# EAGLE schematic velodyne (EAGLE 8.1.0)
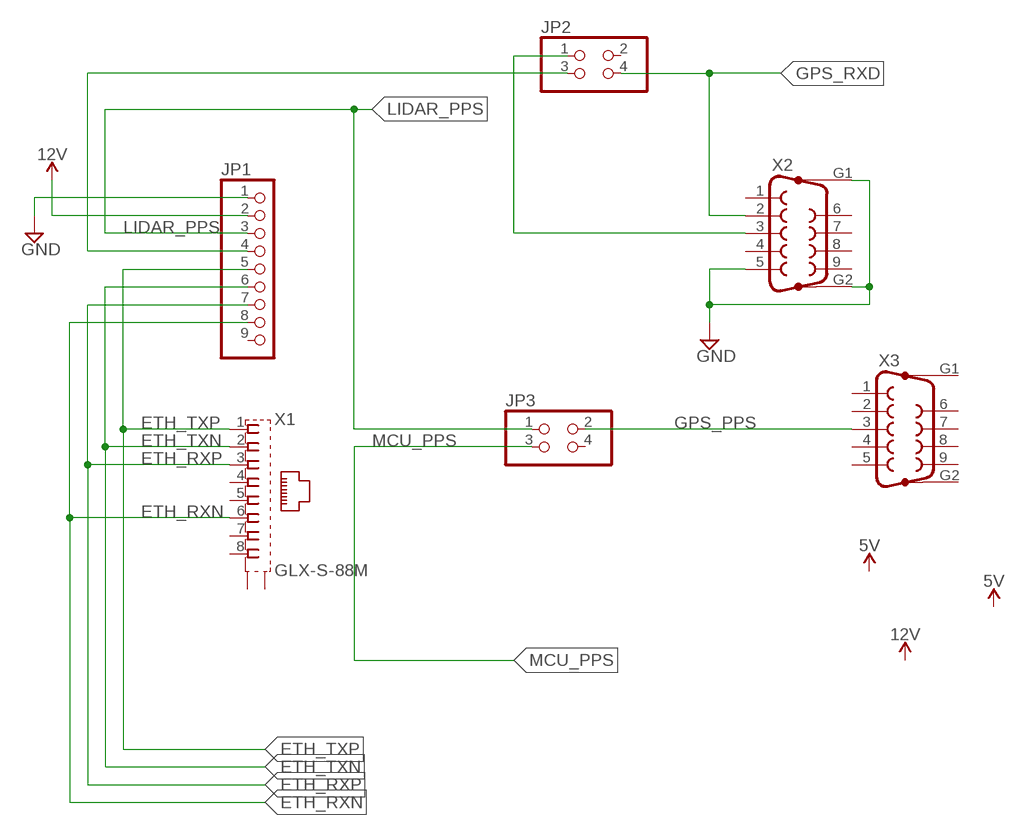
[diagram p0: schematic, sheet 1]

## Parts
JP1  PINHD-1X9  [1X09]
JP2  PINHD-2X2  [2X02]
JP3  PINHD-2X2  [2X02]
X1  GLX-S-88M  [GLX-S-88M]
X2  F09VP  [F09VP]
X3  F09VP  [F09VP]

## Nets
12V: JP1.2
ETH_RXN: JP1.8 X1.6
ETH_RXP: JP1.7 X1.3
ETH_TXN: JP1.6 X1.2
ETH_TXP: JP1.5 X1.1
GND: JP1.1 X2.5 X2.G1 X2.G2
GPS_PPS: JP3.2 X3.3
GPS_RXD: JP2.4 X2.2
LIDAR_PPS: JP1.3 JP3.1
MCU_PPS: JP3.3
N$1: JP1.4 JP2.3
N$2: JP2.1 X2.3
Unconnected: JP1.9 JP2.2 JP3.4 X1.4 X1.5 X1.7 X1.8 X1.S1 X1.S2 X2.1 X2.4 X2.6 X2.7 X2.8 X2.9 X3.1 X3.2 X3.4 X3.5 X3.6 X3.7 X3.8 X3.9 X3.G1 X3.G2

## Library data of the parts
JP1 = pinhead:PINHD-1X9: PIN HEADER
JP2 JP3 = pinhead:PINHD-2X2: PIN HEADER
X1 = con-kycon:GLX-S-88M: Mod. Jack, Right Angle, 8 posiotion, 8 contatcs RJ45 Source: GLX-S-88M.pdf; OC_FARNELL: unknown; OC_NEWARK: unknown
X2 X3 = con-subd:F09VP: SUB-D; OC_FARNELL: unknown; OC_NEWARK: unknown